# Altium project LED 7.PrjPcb
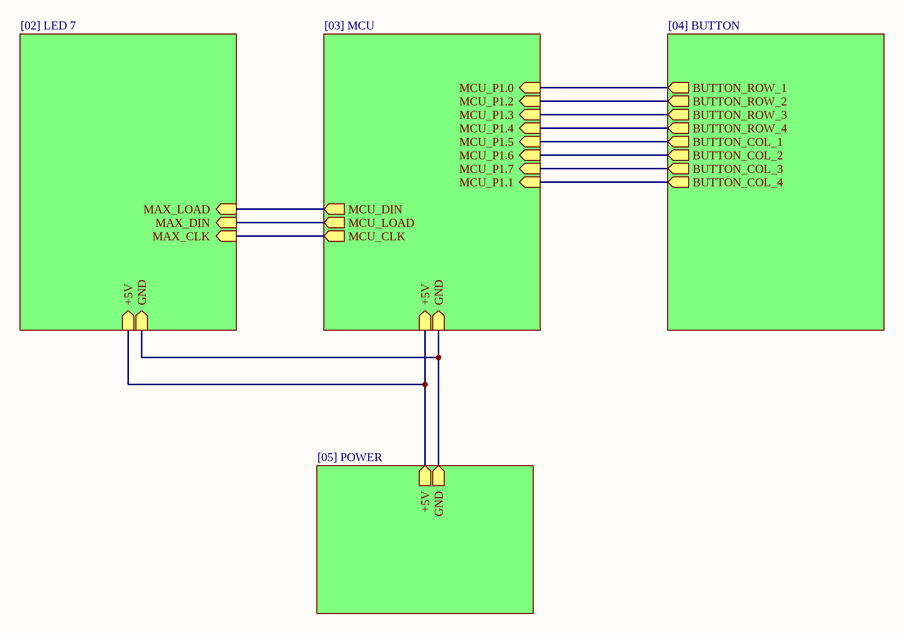
[diagram p0: [01] Schematic.SchDoc]
5 sheets, 32 parts. Net scope: hierarchical (ports join the sheet entries above them; power ports are global).
Board file: PCB.PcbDoc
Sheets:
  [01] Schematic.SchDoc
    1 = [02] LED 7.SchDoc
    2 = [03] MCU.SchDoc
    3 = [04] BUTTON.SchDoc
    Designator = [05] POWER.SchDoc

## Sheet [01] Schematic.SchDoc
size A

### Sub-sheets
1 = [02] LED 7: MAX_LOAD (in), MAX_DIN (in), MAX_CLK (in), +5V (in), GND (in)
2 = [03] MCU: MCU_P1.3 (in), MCU_P1.4 (in), MCU_P1.2 (in), MCU_CLK (out), MCU_P1.1 (in), MCU_P1.0 (in), MCU_DIN (out), MCU_LOAD (out), MCU_P1.6 (in), MCU_P1.5 (in), MCU_P1.7 (in), GND (in), +5V (in)
3 = [04] BUTTON: BUTTON_ROW_1 (out), BUTTON_COL_3 (out), BUTTON_COL_1 (out), BUTTON_COL_4 (out), BUTTON_ROW_2 (out), BUTTON_COL_2 (out), BUTTON_ROW_3 (out), BUTTON_ROW_4 (out)
Designator = [05] POWER: GND (out), +5V (out)

### Nets
+5: sheet 1/+5V, sheet 2/+5V, sheet Designator/+5V
GND: sheet 1/GND, sheet 2/GND, sheet Designator/GND
NetIC1_1: sheet 2/MCU_P1.0, sheet 3/BUTTON_ROW_1
NetIC1_2: sheet 2/MCU_P1.1, sheet 3/BUTTON_COL_4
NetIC1_3: sheet 2/MCU_P1.2, sheet 3/BUTTON_ROW_2
NetIC1_4: sheet 2/MCU_P1.3, sheet 3/BUTTON_ROW_3
NetIC1_5: sheet 2/MCU_P1.4, sheet 3/BUTTON_ROW_4
NetIC1_6: sheet 2/MCU_P1.5, sheet 3/BUTTON_COL_1
NetIC1_7: sheet 2/MCU_P1.6, sheet 3/BUTTON_COL_2
NetIC1_8: sheet 2/MCU_P1.7, sheet 3/BUTTON_COL_3
NetIC1_21: sheet 1/MAX_LOAD, sheet 2/MCU_DIN
NetIC1_22: sheet 1/MAX_DIN, sheet 2/MCU_LOAD
NetIC1_23: sheet 1/MAX_CLK, sheet 2/MCU_CLK

## Sheet [02] LED 7.SchDoc
size A
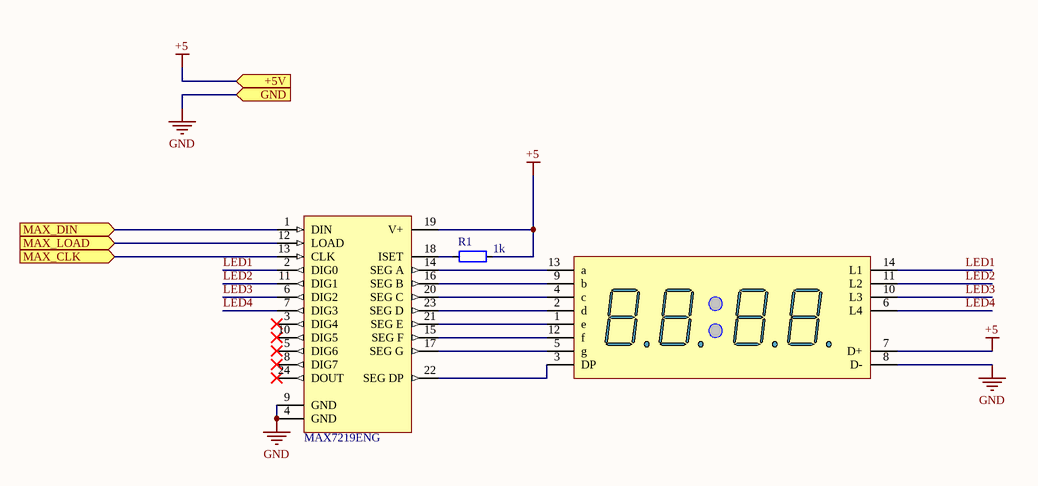
[diagram p1: [02] LED 7.SchDoc]

### Parts
L1  Led 7 Seg 4 digit - Anode  [LED7SEG-4-0.56-RG]  (value not drawn)
M1  MAX7219ENG  [SO24]
R1  1k  [RES-1/2W]

### Ports
+5V (in), GND (in), MAX_CLK (in), MAX_DIN (in), MAX_LOAD (in)

### Nets
+5: L1.7(D+) M1.19(V+) R1.1 ; port +5V
GND: L1.8(D-) M1.4(GND) M1.9(GND) ; port GND
LED1: L1.14(L1) M1.2(DIG0)
LED2: L1.11(L2) M1.11(DIG1)
LED3: L1.10(L3) M1.6(DIG2)
LED4: L1.6(L4) M1.7(DIG3)
NetIC1_21: M1.12(LOAD) ; port MAX_LOAD
NetIC1_22: M1.1(DIN) ; port MAX_DIN
NetIC1_23: M1.13(CLK) ; port MAX_CLK
NetL1_1: L1.1(e) M1.21(SEG_E)
NetL1_2: L1.2(d) M1.23(SEG_D)
NetL1_3: L1.3(DP) M1.22(SEG_DP)
NetL1_4: L1.4(c) M1.20(SEG_C)
NetL1_5: L1.5(g) M1.17(SEG_G)
NetL1_9: L1.9(b) M1.16(SEG_B)
NetL1_12: L1.12(f) M1.15(SEG_F)
NetL1_13: L1.13(a) M1.14(SEG_A)
NetM1_18: M1.18(ISET) R1.2

Not connected (* = marked no-connect by the designer): M1 3(DIG4)* 5(DIG6)* 8(DIG7)* 10(DIG5)* 24(DOUT)*

### Library data of the parts
L1 = LED7SEG-4-RG
M1 = MAX7219ENG: Serially Interfaced, 8-Digit LED Display Driver; Published: 16-Jan-2001; LatestRevisionDate: 29-May-2009; LatestRevisionNote: Component Body Added.; DatasheetVersion: Jul-1997; PackageVersion: 1997; PackageReference: NG24A; Publisher: Altium Limited; PackageDescription: DIP, 24-Pin, Row Spacing 7.62 mm, Pitch 2.54 mm; Code_JEDEC: MS-001-AF; ComponentLink1Description: Manufacturer Link; ComponentLink1URL: http://www.maxim-ic.com/; ComponentLink2Description: Datasheet; ComponentLink2URL: http://pdfserv.maxim-ic.com/en/ds/MAX7219-MAX7221.pdf
R1 = Resistor - DIP: Value: R1/4W - 1K

## Sheet [03] MCU.SchDoc
size A
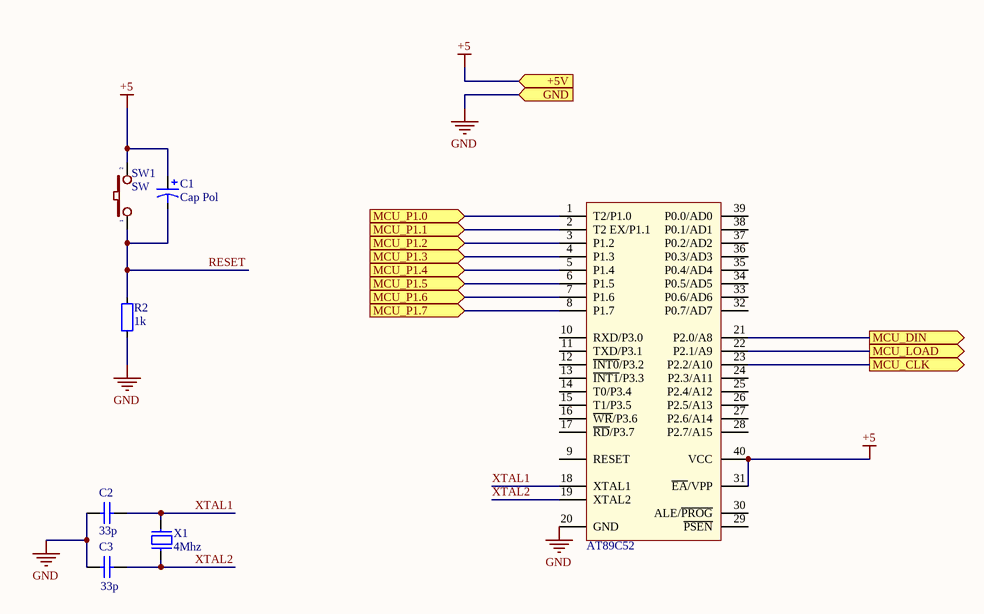
[diagram p2: [03] MCU.SchDoc]

### Parts
C1  Cap Pol  [C3MM]
C2  value 33p  [CAP_CERAMIC]  (hidden comment: Capacitor Ceramic)
C3  value 33p  [CAP_CERAMIC]  (hidden comment: Capacitor Ceramic)
IC1  AT89C52  [DIP40/W0.6]
R2  1k  [RES-1/2W]
SW1  SW  [SW2]
X1  4Mhz  [XT2]

### Ports
+5V (in), GND (in), MCU_CLK (out), MCU_DIN (out), MCU_LOAD (out), MCU_P1.0 (in), MCU_P1.1 (in), MCU_P1.2 (in), MCU_P1.3 (in), MCU_P1.4 (in), MCU_P1.5 (in), MCU_P1.6 (in), MCU_P1.7 (in)

### Nets
+5: C1.1 IC1.31(~{EA}/VPP) IC1.40(VCC) SW1.2 ; port +5V
GND: C2.1 C3.1 IC1.20(GND) R2.1 ; port GND
RESET: C1.2 R2.2 SW1.1
XTAL1: C2.2 IC1.18(XTAL1) X1.2
XTAL2: C3.2 IC1.19(XTAL2) X1.1
NetIC1_1: IC1.1(T2/P1.0) ; port MCU_P1.0
NetIC1_2: IC1.2(T2_EX/P1.1) ; port MCU_P1.1
NetIC1_3: IC1.3(P1.2) ; port MCU_P1.2
NetIC1_4: IC1.4(P1.3) ; port MCU_P1.3
NetIC1_5: IC1.5(P1.4) ; port MCU_P1.4
NetIC1_6: IC1.6(P1.5) ; port MCU_P1.5
NetIC1_7: IC1.7(P1.6) ; port MCU_P1.6
NetIC1_8: IC1.8(P1.7) ; port MCU_P1.7
NetIC1_21: IC1.21(P2.0/A8) ; port MCU_DIN
NetIC1_22: IC1.22(P2.1/A9) ; port MCU_LOAD
NetIC1_23: IC1.23(P2.2/A10) ; port MCU_CLK

Not connected (* = marked no-connect by the designer): IC1 9(RESET) 10(RXD/P3.0) 11(TXD/P3.1) 12(~{INT0}/P3.2) 13(~{INT1}/P3.3) 14(T0/P3.4) 15(T1/P3.5) 16(~{WR}/P3.6) 17(~{RD}/P3.7) 24(P2.3/A11) 25(P2.4/A12) 26(P2.5/A13) 27(P2.6/A14) 28(P2.7/A15) 29(~{PSEN}) 30(ALE/~{PROG}) 32(P0.7/AD7) 33(P0.6/AD6) 34(P0.5/AD5) 35(P0.4/AD4) 36(P0.3/AD3) 37(P0.2/AD2) 38(P0.1/AD1) 39(P0.0/AD0)

### Library data of the parts
C1 = Cap Pol: Polarized Capacitor (Axial); Published: 8-Jun-2000; LatestRevisionDate: 17-Jul-2002; LatestRevisionNote: Re-released for DXP Platform.; PackageReference: POLAR0.8; Publisher: Altium Limited
C2 C3 = CapCeramic: Capacitor; Published: 8-Jun-2000; LatestRevisionDate: 17-Jul-2002; LatestRevisionNote: Re-released for DXP Platform.; PackageReference: RAD-0.3; Publisher: Altium Limited
IC1 = AT89C52: Atmel AT89C52, 8k Byte Flash Memory , 40 Pin; Value: AT89C52
R2 = Resistor - DIP: Value: R1/4W - 1K
SW1 = SW2: Switch button 2 pin; Value: SW chip 2 pin
X1 = XT2: Crystal For all Crystal 2pin.; Value: 4Mhz

## Sheet [04] BUTTON.SchDoc
size A
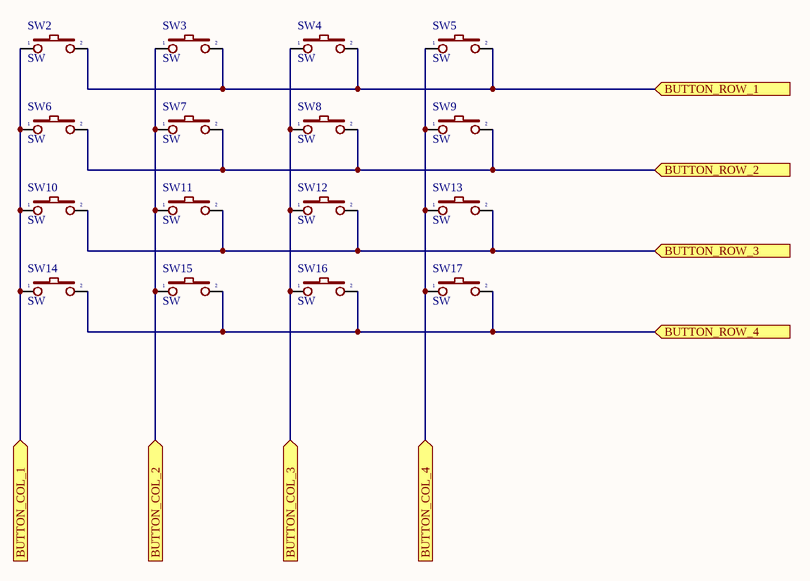
[diagram p3: [04] BUTTON.SchDoc]

### Parts
SW2  SW  [SW2]
SW3  SW  [SW2]
SW4  SW  [SW2]
SW5  SW  [SW2]
SW6  SW  [SW2]
SW7  SW  [SW2]
SW8  SW  [SW2]
SW9  SW  [SW2]
SW10  SW  [SW2]
SW11  SW  [SW2]
SW12  SW  [SW2]
SW13  SW  [SW2]
SW14  SW  [SW2]
SW15  SW  [SW2]
SW16  SW  [SW2]
SW17  SW  [SW2]

### Ports
BUTTON_COL_1 (in), BUTTON_COL_2 (in), BUTTON_COL_3 (in), BUTTON_COL_4 (in), BUTTON_ROW_1 (in), BUTTON_ROW_2 (in), BUTTON_ROW_3 (in), BUTTON_ROW_4 (in)

### Nets
NetIC1_1: SW2.2 SW3.2 SW4.2 SW5.2 ; port BUTTON_ROW_1
NetIC1_2: SW5.1 SW9.1 SW13.1 SW17.1 ; port BUTTON_COL_4
NetIC1_3: SW6.2 SW7.2 SW8.2 SW9.2 ; port BUTTON_ROW_2
NetIC1_4: SW10.2 SW11.2 SW12.2 SW13.2 ; port BUTTON_ROW_3
NetIC1_5: SW14.2 SW15.2 SW16.2 SW17.2 ; port BUTTON_ROW_4
NetIC1_6: SW2.1 SW6.1 SW10.1 SW14.1 ; port BUTTON_COL_1
NetIC1_7: SW3.1 SW7.1 SW11.1 SW15.1 ; port BUTTON_COL_2
NetIC1_8: SW4.1 SW8.1 SW12.1 SW16.1 ; port BUTTON_COL_3

### Library data of the parts
SW2-SW17 = SW2: as SW1 on sheet [03] MCU

## Sheet [05] POWER.SchDoc
size A
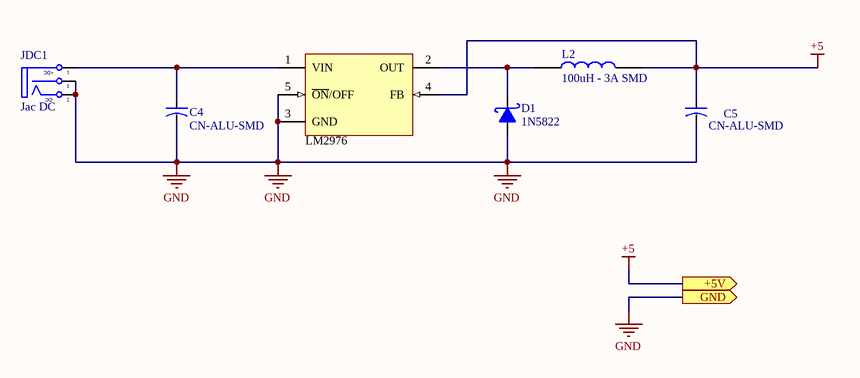
[diagram p4: [05] POWER.SchDoc]

### Parts
C4  CN-ALU-SMD  [CAP-ALU-SMD-F]
C5  CN-ALU-SMD  [CAP-ALU-SMD-F]
D1  1N5822  [DIO-SMD-123]
JDC1  Jac DC  [DC-IN]
L2  100uH - 3A SMD  [Cuon Cam 12x12x10]
U1  LM2976  [TO263]

### Ports
+5V (out), GND (out)

### Nets
+5: C5.1 L2.2 U1.4(FB) ; port +5V
GND: C4.2 C5.2 D1.1(A) JDC1.2(TN) JDC1.3(S) U1.3(GND) U1.5(~{ON}/OFF) ; port GND
NetC4_1: C4.1 JDC1.1(T) U1.1(VIN)
NetD1_2: D1.2(K) L2.1 U1.2(OUT)

### Notes on the sheet
- (in symbol DCIN) +DC; -DC

### Library data of the parts
C4 C5 = CAP-ALU-SMD: Polarized Capacitor (Axial); Published: 8-Jun-2000; LatestRevisionDate: 17-Jul-2002; LatestRevisionNote: Re-released for DXP Platform.; PackageReference: POLAR0.8; Publisher: Altium Limited
D1 = 1N5822: Schottky Rectifiers; Value: Diode c?m 1N5408
JDC1 = DCIN: Jac DC input; Value: Jac DC
L2 = CUON CAM 100uH SMD: Dán; Ma_Hang: MH003999; Don_Vi: Con; Ten_Linh_Kien: Cuộn Cảm 100uH 7x7x4MM CD74; Kieu_Chan: *; Chung_Loai: Dán
U1 = LM2596: Max Input Voltage: 12 V; Max Output Current: 3 (6.0 peak) A; Max Output Voltage: mV; Category: IC-Power; Min Input Voltage: mV; Min Output Voltage: mV; Mounting Technology: Surface Mount; Status: Unreleased; Supply Voltage: mV; Temperature Range: -40 to +125 degC

## Nets that join several sheets
+5: [02] LED 7 (L1.7 M1.19 R1.1), [03] MCU (C1.1 IC1.31 IC1.40 SW1.2), [05] POWER (C5.1 L2.2 U1.4)
GND: [02] LED 7 (L1.8 M1.4 M1.9), [03] MCU (C2.1 C3.1 IC1.20 R2.1), [05] POWER (7 pins)
NetIC1_1: [03] MCU (IC1.1), [04] BUTTON (SW2.2 SW3.2 SW4.2 SW5.2)
NetIC1_2: [03] MCU (IC1.2), [04] BUTTON (SW5.1 SW9.1 SW13.1 SW17.1)
NetIC1_3: [03] MCU (IC1.3), [04] BUTTON (SW6.2 SW7.2 SW8.2 SW9.2)
NetIC1_4: [03] MCU (IC1.4), [04] BUTTON (SW10.2 SW11.2 SW12.2 SW13.2)
NetIC1_5: [03] MCU (IC1.5), [04] BUTTON (SW14.2 SW15.2 SW16.2 SW17.2)
NetIC1_6: [03] MCU (IC1.6), [04] BUTTON (SW2.1 SW6.1 SW10.1 SW14.1)
NetIC1_7: [03] MCU (IC1.7), [04] BUTTON (SW3.1 SW7.1 SW11.1 SW15.1)
NetIC1_8: [03] MCU (IC1.8), [04] BUTTON (SW4.1 SW8.1 SW12.1 SW16.1)
NetIC1_21: [02] LED 7 (M1.12), [03] MCU (IC1.21)
NetIC1_22: [02] LED 7 (M1.1), [03] MCU (IC1.22)
NetIC1_23: [02] LED 7 (M1.13), [03] MCU (IC1.23)